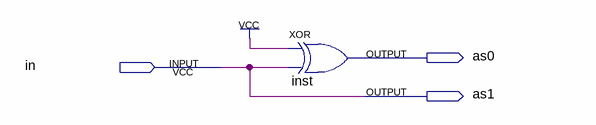
[diagram p0: schematic sheet]
// Quartus schematic switchingVCC.bdf as structural Verilog: 1 symbols, 3 pins
module switchingVCC (
  input  in,
  output as0,
  output as1
);

  xor inst (as0, 1'b1, in);

  assign as1 = in;
endmodule
